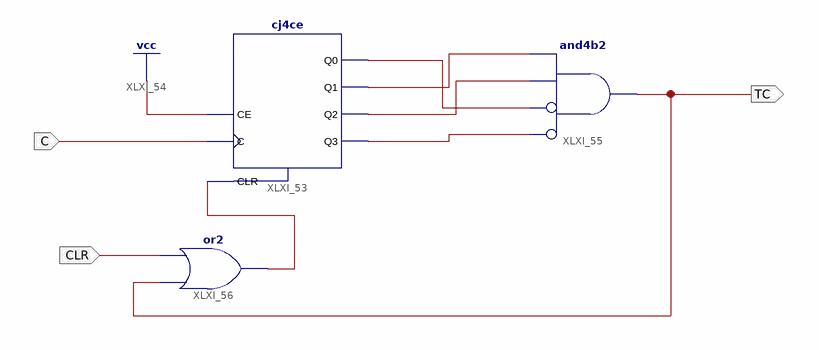
[diagram p0: schematic sheet 1]
// Xilinx ISE schematic Div5.sch (spartan6) as structural Verilog: 3 symbols, 3 ports
module Div5 (
  input  C,
  input  CLR,
  output TC
);

  wire XLXN_134, XLXN_139, XLXN_140, XLXN_141, XLXN_142;

  cj4ce XLXI_53 (.C(C), .CE(1'b1), .CLR(XLXN_134), .Q0(XLXN_141), .Q1(XLXN_139), .Q2(XLXN_140), .Q3(XLXN_142));
  and XLXI_55 (TC, ~XLXN_142, ~XLXN_141, XLXN_140, XLXN_139);  // and4b2
  or XLXI_56 (XLXN_134, TC, CLR);
endmodule
